# Altium schematic sheet CONNECTOR_TEST_LVDS.SchDoc
size A3; SheetNumber: 6; SheetTotal: 24
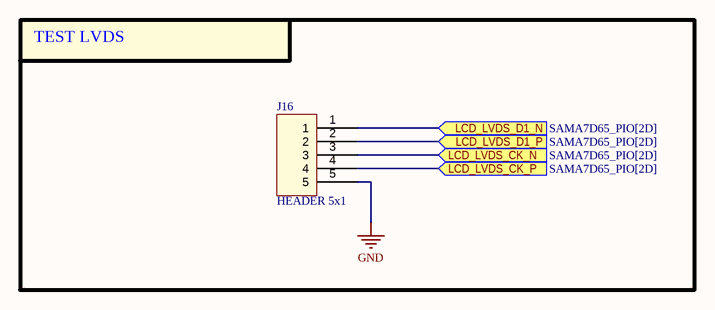
[diagram p0: CONNECTOR_TEST_LVDS.SchDoc]

## Parts
J16  HEADER 5x1  [Header_254P_5x1]

## Blocks framed on the sheet
TEST LVDS: J16

## Ports
LCD_LVDS_CK_N (in, see SAMA7D65_PIO[2D]), LCD_LVDS_CK_P (in, see SAMA7D65_PIO[2D]), LCD_LVDS_D1_N (in, see SAMA7D65_PIO[2D]), LCD_LVDS_D1_P (in, see SAMA7D65_PIO[2D])

## Nets
GND: J16.5
LCD_LVDS_CK_N: J16.3 ; port LCD_LVDS_CK_N
LCD_LVDS_CK_P: J16.4 ; port LCD_LVDS_CK_P
LCD_LVDS_D1_N: J16.1 ; port LCD_LVDS_D1_N
LCD_LVDS_D1_P: J16.2 ; port LCD_LVDS_D1_P

## Notes on the sheet
- Project:
- Page Contents:
- Revision:
- Design:
- Date:
- Size:
- A3
- Document Number:
- Sheet:
- of